# Altium schematic sheet IO_Converter.SchDoc: IO Converter
size Letter; Engineer: Brandt Buchda; Revision: B; SheetNumber: 1; SheetTotal: 4
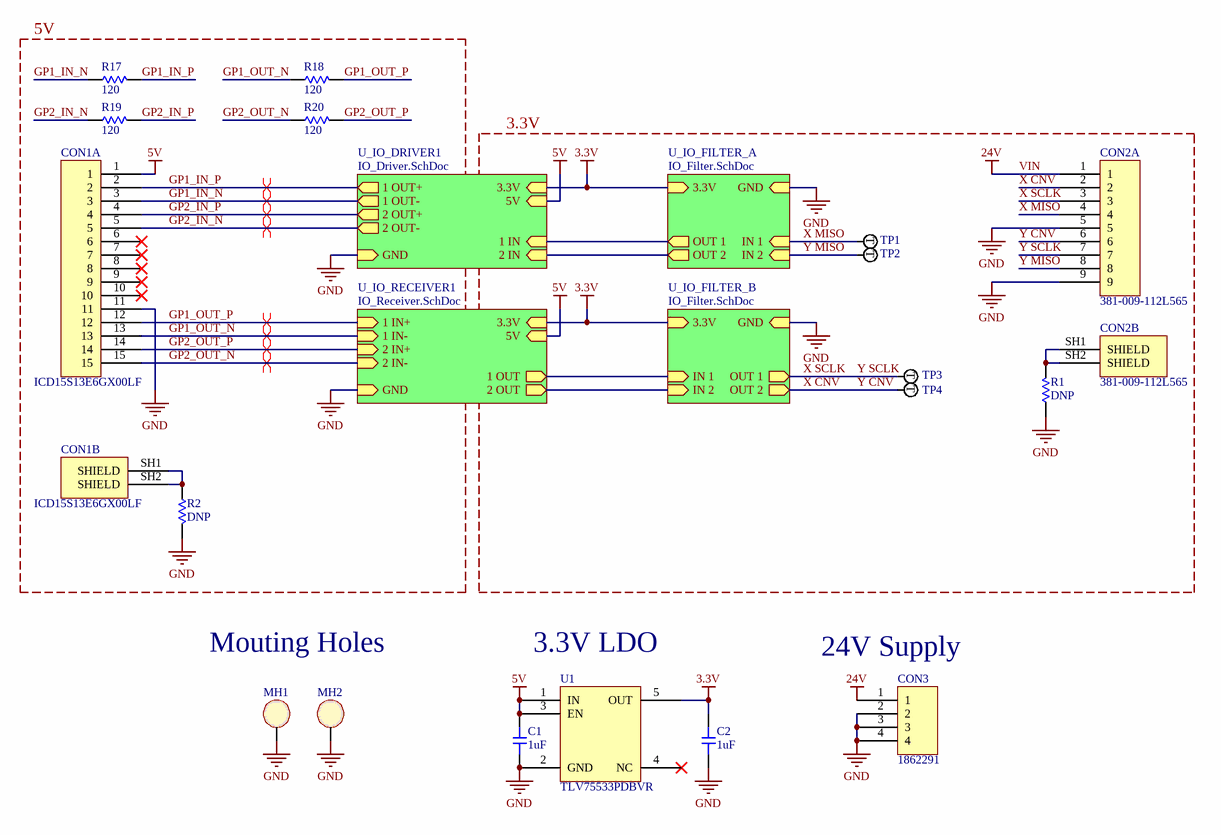
[diagram p0: IO_Converter.SchDoc]

## Parts
C1  value 1uF  [0603-CAP]  (hidden comment: CL10A105KP8NNWC)
C2  value 1uF  [0603-CAP]  (hidden comment: CL10A105KP8NNWC)
CON1  ICD15S13E6GX00LF  [ICD15S13E6GX00LF]  (parts A,B of 2)
CON2  381-009-112L565  [381-009-112L565]  (parts A,B of 2)
CON3  1862291  [1862291]
MH1  MOUNT_HOLE  [MOUNTING_HOLE]  (value not drawn)  (no BOM)
MH2  MOUNT_HOLE  [MOUNTING_HOLE]  (value not drawn)  (no BOM)
R1  value DNP  [0603-RES]  (hidden comment: Resistor)  (no BOM)
R2  value DNP  [0603-RES]  (hidden comment: Resistor)  (no BOM)
R17  value 120  [0603-RES]  (hidden comment: RMCF0603JT120R)
R18  value 120  [0603-RES]  (hidden comment: RMCF0603JT120R)
R19  value 120  [0603-RES]  (hidden comment: RMCF0603JT120R)
R20  value 120  [0603-RES]  (hidden comment: RMCF0603JT120R)
TP1  RCU-0C  [RCU-0C]  (value not drawn)
TP2  RCU-0C  [RCU-0C]  (value not drawn)
TP3  RCU-0C  [RCU-0C]  (value not drawn)
TP4  RCU-0C  [RCU-0C]  (value not drawn)
U1  TLV75533PDBVR  [SOT95P280X145-5N]

## Blocks framed on the sheet
5V: CON1 R2 R17-R20
3.3V: CON2 R1 TP1-TP4

## Sub-sheets
U_IO_DRIVER1 = IO_Driver.SchDoc: 5V (in), 3.3V (in), GND (in), 1 IN (in), 2 IN (in), 1 OUT+ (out), 1 OUT- (out), 2 OUT+ (out), 2 OUT- (out)
U_IO_FILTER_A = IO_Filter.SchDoc: IN 1 (in), IN 2 (in), OUT 1 (out), OUT 2 (out), 3.3V (in), GND (in)
U_IO_FILTER_B = IO_Filter.SchDoc: IN 1 (in), IN 2 (in), OUT 1 (out), OUT 2 (out), 3.3V (in), GND (in)
U_IO_RECEIVER1 = IO_Receiver.SchDoc: 5V (in), 3.3V (in), GND (in), 1 OUT (out), 2 OUT (out), 1 IN+ (in), 1 IN- (in), 2 IN+ (in), 2 IN- (in)

## Nets
3.3V: C2.2 U1.5(OUT) ; sheet U_IO_FILTER_B/3.3V, sheet U_IO_FILTER_A/3.3V, sheet U_IO_DRIVER1/3.3V, sheet U_IO_RECEIVER1/3.3V
5V: C1.2 CON1.1 U1.1(IN) U1.3(EN) ; sheet U_IO_DRIVER1/5V, sheet U_IO_RECEIVER1/5V
GND: C1.1 C2.1 CON1.11 CON2.5 CON2.9 CON3.2 CON3.3 CON3.4 MH1.1 MH2.1 R1.2 R2.2 U1.2(GND) ; sheet U_IO_FILTER_B/GND, sheet U_IO_FILTER_A/GND, sheet U_IO_DRIVER1/GND, sheet U_IO_RECEIVER1/GND
VIN: CON2.1 CON3.1  [also labelled 24V]
GP1_IN_N: CON1.3 R17.1 ; sheet U_IO_DRIVER1/1 OUT-
GP1_IN_P: CON1.2 R17.2 ; sheet U_IO_DRIVER1/1 OUT+
GP1_OUT_N: CON1.13 R18.1 ; sheet U_IO_RECEIVER1/1 IN-
GP1_OUT_P: CON1.12 R18.2 ; sheet U_IO_RECEIVER1/1 IN+
GP2_IN_N: CON1.5 R19.1 ; sheet U_IO_DRIVER1/2 OUT-
GP2_IN_P: CON1.4 R19.2 ; sheet U_IO_DRIVER1/2 OUT+
GP2_OUT_N: CON1.15 R20.1 ; sheet U_IO_RECEIVER1/2 IN-
GP2_OUT_P: CON1.14 R20.2 ; sheet U_IO_RECEIVER1/2 IN+
X CNV: CON2.2 CON2.6 TP4.1 ; sheet U_IO_FILTER_B/OUT 2  [also labelled Y CNV]
X MISO: CON2.4 TP1.1 ; sheet U_IO_FILTER_A/IN 1
X SCLK: CON2.3 CON2.7 TP3.1 ; sheet U_IO_FILTER_B/OUT 1  [also labelled Y SCLK]
Y MISO: CON2.8 TP2.1 ; sheet U_IO_FILTER_A/IN 2
NetCON1_SH1: CON1.SH1(SHIELD) CON1.SH2(SHIELD) R2.1
NetCON2_SH1: CON2.SH1(SHIELD) CON2.SH2(SHIELD) R1.1
(unnamed): sheet U_IO_FILTER_B/IN 1, sheet U_IO_RECEIVER1/1 OUT
(unnamed): sheet U_IO_FILTER_B/IN 2, sheet U_IO_RECEIVER1/2 OUT
(unnamed): sheet U_IO_FILTER_A/OUT 1, sheet U_IO_DRIVER1/1 IN
(unnamed): sheet U_IO_FILTER_A/OUT 2, sheet U_IO_DRIVER1/2 IN

Not connected (* = marked no-connect by the designer): CON1 6* 7* 8* 9* 10*; U1 4(NC)*

## Layout directives
differential pair: GP1_IN_N, GP1_IN_P, GP1_OUT_N, GP1_OUT_P, GP2_IN_N, GP2_IN_P, GP2_OUT_N, GP2_OUT_P

## Notes on the sheet
- Mouting Holes
- (near U1) 3.3V LDO
- (near CON3) 24V Supply
- Title:
- File:
- Sheet:
- of
- Revision:
- Time:
- Date:
- Engineer:
- (in symbol Test Point) T

## Library data of the parts
C1 C2 = Capacitor 1uF: CAP CER 1UF 10V X5R 0603; Supplier 1: Digi-Key; Supplier Part Number 1: 1276-1863-1-ND
CON1 = ICD15S13E6GX00LF: 15 Position D-Sub, High Density Receptacle, Female Sockets Connector; Supplier Part Number 1: 609-2801-ND; Supplier 1: Digi-Key
CON2 = 381-009-112L565: 9 Position D-Type, Micro-D Plug, Male Pins Connector; Supplier 1: DigiKey; Supplier Part Number 1: NOR1136-ND
CON3 = 1862291: TERM BLOCK 4POS 45DEG 5MM PCB; Supplier 1: DigiKey; Supplier Part Number 1: 277-12141-ND
MH1 MH2 = MOUNT_HOLE: MOUNTING HOLE
R1 R2 = Resistor: DNP; Supplier 1: Digi-Key
R17-R20 = Resistor: RES 120 OHM 5% 1/10W 0603
  R17-R19: Supplier: Digikey; Manufacturer Part Number: RMCF0603JT120R
  R20: Supplier 1: Digikey; Supplier Part Number 1: RMCF0603JT120R
TP1-TP4 = Test Point: PC TEST POINT NATURAL; Material - Insulation: No Insulation; Manufacturer Part Number: RCU-0C; Supplier Part Number: *; Supplier: *; Footprint: *; Supplier 1: Digi-Key; RoHS: RoHS Compliant; Category: Test and Measurement; Stock 1: 136646; Pricing 1: 1=0.22, 10=0.206, 25=0.1756, 50=0.1536, 100=0.1426, 250=0.12616, 500=0.12068, 1000=0.09874 (USD); Packaging: Cut Tape (CT); Part Status: Active; Type: PC Test Point; Mounting Type: Surface Mount; Color: Natural; Size / Dimension: 0.063" x 0.031" x 0.045" (1.60mm x 0.80mm x 1.15mm); Plating: -; Material - Body: -; ComponentLink1URL: http://www.te.com/commerce/DocumentDelivery/DDEController?Action=srchrtrv&DocNm=1773266&DocType=DS&DocLang=English; ComponentLink1Description: http://www.te.com/commerce/DocumentDelivery/DDEController?Action=srchrtrv&DocNm=1773266&DocType=DS&DocLang=English; Supplier Part Number 1: A106145CT-ND
U1 = TLV75533PDBVR: IC REG LINEAR 3.3V 500MA SOT23-5; Supplier 1: Digi-Key; Supplier Part Number 1: 296-50411-1-ND